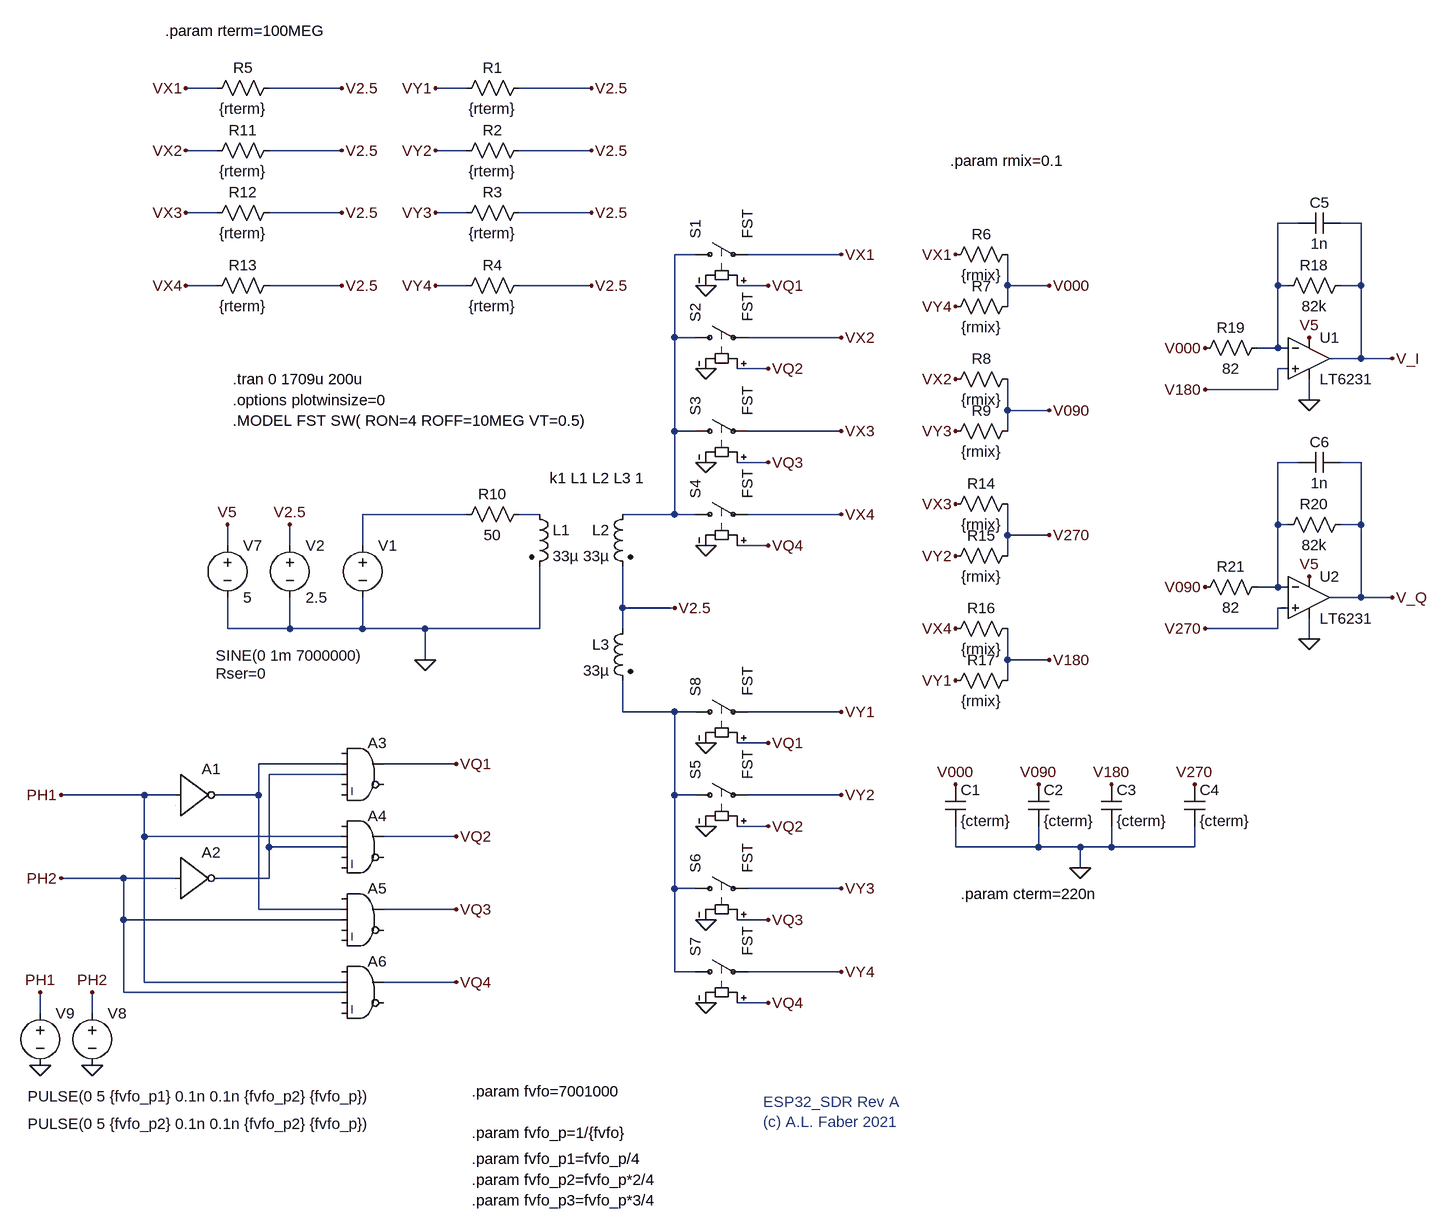
[diagram p0: schematic qsd_model.asc]
qsd_model.asc, the LTspice schematic file:
Version 4
SHEET 1 2544 1324
WIRE -176 -672 -224 -672
WIRE 16 -672 -96 -672
WIRE 208 -672 160 -672
WIRE 400 -672 288 -672
WIRE -176 -576 -224 -576
WIRE 16 -576 -96 -576
WIRE 208 -576 160 -576
WIRE 400 -576 288 -576
WIRE -176 -480 -224 -480
WIRE 16 -480 -96 -480
WIRE 208 -480 160 -480
WIRE 400 -480 288 -480
WIRE 1488 -464 1456 -464
WIRE 1584 -464 1552 -464
WIRE 560 -416 528 -416
WIRE 784 -416 640 -416
WIRE -176 -368 -224 -368
WIRE 16 -368 -96 -368
WIRE 208 -368 160 -368
WIRE 400 -368 288 -368
WIRE 672 -368 624 -368
WIRE 1040 -368 1040 -416
WIRE 1104 -368 1040 -368
WIRE 1456 -368 1456 -464
WIRE 1472 -368 1456 -368
WIRE 1584 -368 1584 -464
WIRE 1584 -368 1552 -368
WIRE 1040 -336 1040 -368
WIRE 528 -288 528 -416
WIRE 560 -288 528 -288
WIRE 784 -288 640 -288
WIRE 1456 -272 1456 -368
WIRE 1456 -272 1424 -272
WIRE 1472 -272 1456 -272
WIRE 1584 -256 1584 -368
WIRE 1584 -256 1536 -256
WIRE 1632 -256 1584 -256
WIRE 672 -240 624 -240
WIRE 1472 -240 1456 -240
WIRE 1456 -208 1456 -240
WIRE 1456 -208 1344 -208
WIRE 1504 -192 1504 -224
WIRE 1040 -176 1040 -224
WIRE 1104 -176 1040 -176
WIRE 528 -144 528 -288
WIRE 560 -144 528 -144
WIRE 784 -144 640 -144
WIRE 1040 -144 1040 -176
WIRE 672 -96 624 -96
WIRE 1488 -96 1456 -96
WIRE 1584 -96 1552 -96
WIRE 208 -16 48 -16
WIRE 320 -16 288 -16
WIRE 528 -16 528 -144
WIRE 528 -16 448 -16
WIRE 560 -16 528 -16
WIRE 784 -16 640 -16
WIRE 1456 0 1456 -96
WIRE 1472 0 1456 0
WIRE 1584 0 1584 -96
WIRE 1584 0 1552 0
WIRE 1040 16 1040 -32
WIRE 1104 16 1040 16
WIRE -160 32 -160 0
WIRE -64 32 -64 0
WIRE 48 32 48 -16
WIRE 672 32 624 32
WIRE 1040 48 1040 16
WIRE 1456 96 1456 0
WIRE 1456 96 1424 96
WIRE 1472 96 1456 96
WIRE 1584 112 1584 0
WIRE 1584 112 1536 112
WIRE 1632 112 1584 112
WIRE 448 128 448 64
WIRE 528 128 448 128
WIRE 1472 128 1456 128
WIRE -160 160 -160 112
WIRE -64 160 -64 112
WIRE -64 160 -160 160
WIRE 48 160 48 112
WIRE 48 160 -64 160
WIRE 144 160 48 160
WIRE 320 160 320 64
WIRE 320 160 144 160
WIRE 448 160 448 128
WIRE 1456 160 1456 128
WIRE 1456 160 1344 160
WIRE 1504 176 1504 144
WIRE 144 208 144 160
WIRE 1040 208 1040 160
WIRE 1104 208 1040 208
WIRE 1040 240 1040 208
WIRE 448 288 448 240
WIRE 528 288 448 288
WIRE 560 288 528 288
WIRE 784 288 640 288
WIRE 672 336 624 336
WIRE 16 368 -112 368
WIRE 192 368 80 368
WIRE 16 384 -96 384
WIRE -288 416 -416 416
WIRE -240 416 -288 416
WIRE -112 416 -112 368
WIRE -112 416 -176 416
WIRE 528 416 528 288
WIRE 560 416 528 416
WIRE 784 416 640 416
WIRE 672 464 624 464
WIRE -288 480 -288 416
WIRE 16 480 -288 480
WIRE 192 480 80 480
WIRE -96 496 -96 384
WIRE 16 496 -96 496
WIRE 960 496 960 464
WIRE 1088 496 1088 464
WIRE 1088 496 960 496
WIRE 1152 496 1088 496
WIRE 1200 496 1200 464
WIRE 1200 496 1152 496
WIRE 1328 496 1328 464
WIRE 1328 496 1200 496
WIRE 1152 528 1152 496
WIRE -320 544 -416 544
WIRE -240 544 -320 544
WIRE -96 544 -96 496
WIRE -96 544 -176 544
WIRE 528 560 528 416
WIRE 560 560 528 560
WIRE 784 560 640 560
WIRE -112 592 -112 416
WIRE 16 592 -112 592
WIRE 192 592 80 592
WIRE -320 608 -320 544
WIRE 16 608 -320 608
WIRE 672 608 624 608
WIRE 528 688 528 560
WIRE 560 688 528 688
WIRE 784 688 640 688
WIRE -288 704 -288 480
WIRE 16 704 -288 704
WIRE 192 704 80 704
WIRE -320 720 -320 608
WIRE 16 720 -320 720
WIRE 672 736 624 736
WIRE -448 752 -448 720
WIRE -368 752 -368 720
FLAG -64 0 V2.5
FLAG -160 0 V5
FLAG 576 -368 0
FLAG 576 -240 0
FLAG 576 -96 0
FLAG 576 32 0
FLAG -416 544 PH2
FLAG -448 720 PH1
FLAG -368 720 PH2
FLAG -448 832 0
FLAG -368 832 0
FLAG 192 480 VQ2
FLAG 192 592 VQ3
FLAG 192 704 VQ4
FLAG 192 368 VQ1
FLAG 400 -672 V2.5
FLAG 400 -576 V2.5
FLAG 400 -480 V2.5
FLAG 400 -368 V2.5
FLAG 672 -368 VQ1
FLAG 144 208 0
FLAG 672 -240 VQ2
FLAG 672 -96 VQ3
FLAG 672 32 VQ4
FLAG 576 336 0
FLAG 576 464 0
FLAG 576 608 0
FLAG 576 736 0
FLAG 672 336 VQ1
FLAG 672 464 VQ2
FLAG 672 608 VQ3
FLAG 672 736 VQ4
FLAG 528 128 V2.5
FLAG 784 -416 VX1
FLAG 160 -672 VY1
FLAG 784 -288 VX2
FLAG 160 -576 VY2
FLAG 784 -144 VX3
FLAG 160 -480 VY3
FLAG 160 -368 VY4
FLAG 784 -16 VX4
FLAG 16 -672 V2.5
FLAG 16 -576 V2.5
FLAG 16 -480 V2.5
FLAG 16 -368 V2.5
FLAG -224 -672 VX1
FLAG -224 -576 VX2
FLAG -224 -480 VX3
FLAG -224 -368 VX4
FLAG 784 288 VY1
FLAG 784 416 VY2
FLAG 784 560 VY3
FLAG 784 688 VY4
FLAG 960 -416 VX1
FLAG 960 -336 VY4
FLAG 1104 -368 V000
FLAG 960 -224 VX2
FLAG 960 -144 VY3
FLAG 1104 -176 V090
FLAG 960 -32 VX3
FLAG 960 48 VY2
FLAG 1104 16 V270
FLAG 960 160 VX4
FLAG 960 240 VY1
FLAG 1104 208 V180
FLAG 960 400 V000
FLAG 1088 400 V090
FLAG 1200 400 V180
FLAG 1328 400 V270
FLAG 1152 528 0
FLAG 1504 -288 V5
FLAG 1504 -192 0
FLAG 1344 -272 V000
FLAG 1344 -208 V180
FLAG 1632 -256 V_I
FLAG 1504 80 V5
FLAG 1504 176 0
FLAG 1344 96 V090
FLAG 1344 160 V270
FLAG 1632 112 V_Q
FLAG -416 416 PH1
SYMBOL voltage 48 16 R0
WINDOW 3 -226 185 Left 2
WINDOW 123 0 0 Left 0
WINDOW 39 -226 213 Left 2
SYMATTR Value SINE(0 1m 7000000)
SYMATTR SpiceLine Rser=0
SYMATTR InstName V1
SYMBOL voltage -64 16 R0
WINDOW 123 0 0 Left 0
WINDOW 39 0 0 Left 0
SYMATTR InstName V2
SYMATTR Value 2.5
SYMBOL voltage -160 16 R0
WINDOW 123 0 0 Left 0
WINDOW 39 0 0 Left 0
SYMATTR InstName V7
SYMATTR Value 5
SYMBOL sw 544 -288 R270
SYMATTR InstName S2
SYMATTR Value FST
SYMBOL sw 544 -144 R270
SYMATTR InstName S3
SYMATTR Value FST
SYMBOL sw 544 -16 R270
SYMATTR InstName S4
SYMATTR Value FST
SYMBOL Digital\\inv -240 352 R0
SYMATTR InstName A1
SYMBOL Digital\\inv -240 480 R0
SYMATTR InstName A2
SYMBOL Digital\\and 48 320 R0
SYMATTR InstName A3
SYMBOL Digital\\and 48 432 R0
SYMATTR InstName A4
SYMBOL Digital\\and 48 544 R0
SYMATTR InstName A5
SYMBOL Digital\\and 48 656 R0
SYMATTR InstName A6
SYMBOL voltage -368 736 R0
WINDOW 3 -99 186 Left 2
WINDOW 123 0 0 Left 0
WINDOW 39 0 0 Left 0
SYMATTR Value PULSE(0 5 {fvfo_p2} 0.1n 0.1n {fvfo_p2} {fvfo_p})
SYMATTR InstName V8
SYMBOL voltage -448 736 R0
WINDOW 3 -19 144 Left 2
WINDOW 123 0 0 Left 0
WINDOW 39 0 0 Left 0
SYMATTR Value PULSE(0 5 {fvfo_p1} 0.1n 0.1n {fvfo_p2} {fvfo_p})
SYMATTR InstName V9
SYMBOL sw 544 -416 R270
SYMATTR InstName S1
SYMATTR Value FST
SYMBOL res 304 -688 R90
WINDOW 0 0 56 VBottom 2
WINDOW 3 32 56 VTop 2
SYMATTR InstName R1
SYMATTR Value {rterm}
SYMBOL res 304 -592 R90
WINDOW 0 0 56 VBottom 2
WINDOW 3 32 56 VTop 2
SYMATTR InstName R2
SYMATTR Value {rterm}
SYMBOL res 304 -496 R90
WINDOW 0 0 56 VBottom 2
WINDOW 3 32 56 VTop 2
SYMATTR InstName R3
SYMATTR Value {rterm}
SYMBOL res 304 -384 R90
WINDOW 0 0 56 VBottom 2
WINDOW 3 32 56 VTop 2
SYMATTR InstName R4
SYMATTR Value {rterm}
SYMBOL sw 544 416 R270
SYMATTR InstName S5
SYMATTR Value FST
SYMBOL sw 544 560 R270
SYMATTR InstName S6
SYMATTR Value FST
SYMBOL sw 544 688 R270
SYMATTR InstName S7
SYMATTR Value FST
SYMBOL sw 544 288 R270
SYMATTR InstName S8
SYMATTR Value FST
SYMBOL res 304 -32 R90
WINDOW 0 0 56 VBottom 2
WINDOW 3 32 56 VTop 2
SYMATTR InstName R10
SYMATTR Value 50
SYMBOL ind2 304 -32 R0
SYMATTR InstName L1
SYMATTR Value 33µ
SYMATTR Type ind
SYMBOL ind2 464 -32 M0
SYMATTR InstName L2
SYMATTR Value 33µ
SYMATTR Type ind
SYMBOL ind2 464 144 M0
SYMATTR InstName L3
SYMATTR Value 33µ
SYMATTR Type ind
SYMBOL res -80 -688 R90
WINDOW 0 0 56 VBottom 2
WINDOW 3 32 56 VTop 2
SYMATTR InstName R5
SYMATTR Value {rterm}
SYMBOL res -80 -592 R90
WINDOW 0 0 56 VBottom 2
WINDOW 3 32 56 VTop 2
SYMATTR InstName R11
SYMATTR Value {rterm}
SYMBOL res -80 -496 R90
WINDOW 0 0 56 VBottom 2
WINDOW 3 32 56 VTop 2
SYMATTR InstName R12
SYMATTR Value {rterm}
SYMBOL res -80 -384 R90
WINDOW 0 0 56 VBottom 2
WINDOW 3 32 56 VTop 2
SYMATTR InstName R13
SYMATTR Value {rterm}
SYMBOL res 1056 -432 R90
WINDOW 0 0 56 VBottom 2
WINDOW 3 32 56 VTop 2
SYMATTR InstName R6
SYMATTR Value {rmix}
SYMBOL res 1056 -352 R90
WINDOW 0 0 56 VBottom 2
WINDOW 3 32 56 VTop 2
SYMATTR InstName R7
SYMATTR Value {rmix}
SYMBOL res 1056 -240 R90
WINDOW 0 0 56 VBottom 2
WINDOW 3 32 56 VTop 2
SYMATTR InstName R8
SYMATTR Value {rmix}
SYMBOL res 1056 -160 R90
WINDOW 0 0 56 VBottom 2
WINDOW 3 32 56 VTop 2
SYMATTR InstName R9
SYMATTR Value {rmix}
SYMBOL res 1056 -48 R90
WINDOW 0 0 56 VBottom 2
WINDOW 3 32 56 VTop 2
SYMATTR InstName R14
SYMATTR Value {rmix}
SYMBOL res 1056 32 R90
WINDOW 0 0 56 VBottom 2
WINDOW 3 32 56 VTop 2
SYMATTR InstName R15
SYMATTR Value {rmix}
SYMBOL res 1056 144 R90
WINDOW 0 0 56 VBottom 2
WINDOW 3 32 56 VTop 2
SYMATTR InstName R16
SYMATTR Value {rmix}
SYMBOL res 1056 224 R90
WINDOW 0 0 56 VBottom 2
WINDOW 3 32 56 VTop 2
SYMATTR InstName R17
SYMATTR Value {rmix}
SYMBOL cap 944 400 R0
SYMATTR InstName C1
SYMATTR Value {cterm}
SYMBOL cap 1072 400 R0
SYMATTR InstName C2
SYMATTR Value {cterm}
SYMBOL cap 1184 400 R0
SYMATTR InstName C3
SYMATTR Value {cterm}
SYMBOL cap 1312 400 R0
SYMATTR InstName C4
SYMATTR Value {cterm}
SYMBOL Opamps\\LT6231 1504 -256 R0
SYMATTR InstName U1
SYMBOL res 1568 -384 R90
WINDOW 0 0 56 VBottom 2
WINDOW 3 32 56 VTop 2
SYMATTR InstName R18
SYMATTR Value 82k
SYMBOL cap 1552 -480 R90
WINDOW 0 0 32 VBottom 2
WINDOW 3 32 32 VTop 2
SYMATTR InstName C5
SYMATTR Value 1n
SYMBOL res 1440 -288 R90
WINDOW 0 0 56 VBottom 2
WINDOW 3 32 56 VTop 2
SYMATTR InstName R19
SYMATTR Value 82
SYMBOL Opamps\\LT6231 1504 112 R0
SYMATTR InstName U2
SYMBOL res 1568 -16 R90
WINDOW 0 0 56 VBottom 2
WINDOW 3 32 56 VTop 2
SYMATTR InstName R20
SYMATTR Value 82k
SYMBOL cap 1552 -112 R90
WINDOW 0 0 32 VBottom 2
WINDOW 3 32 32 VTop 2
SYMATTR InstName C6
SYMATTR Value 1n
SYMBOL res 1440 80 R90
WINDOW 0 0 56 VBottom 2
WINDOW 3 32 56 VTop 2
SYMATTR InstName R21
SYMATTR Value 82
TEXT 216 872 Left 2 !.param fvfo=7001000
TEXT -152 -224 Left 2 !.tran 0 1709u 200u
TEXT 216 936 Left 2 !.param fvfo_p=1/{fvfo}
TEXT 216 976 Left 2 !.param fvfo_p1=fvfo_p/4
TEXT 216 1008 Left 2 !.param fvfo_p2=fvfo_p*2/4
TEXT 216 1040 Left 2 !.param fvfo_p3=fvfo_p*3/4
TEXT -152 -192 Left 2 !.options plotwinsize=0
TEXT -152 -160 Left 2 !.MODEL FST SW( RON=4 ROFF=10MEG VT=0.5)
TEXT 336 -72 Left 2 !k1 L1 L2 L3 1
TEXT -256 -760 Left 2 !.param rterm=100MEG
TEXT 952 -560 Left 2 !.param rmix=0.1
TEXT 968 568 Left 2 !.param cterm=220n
TEXT 664 888 Left 2 ;ESP32_SDR Rev A \n(c) A.L. Faber 2021

The netlist it stands for:
* qsd_model.asc
V1 N004 0 SINE(0 1m 7000000) Rser=0
V2 V2.5 0 2.5
V7 V5 0 5
S2 N002 VX2 VQ2 0 FST
S3 N002 VX3 VQ3 0 FST
S4 N002 VX4 VQ4 0 FST
A1 PH1 0 0 0 0 N007 0 0 BUF
A2 PH2 0 0 0 0 N008 0 0 BUF
A3 0 N007 N008 0 0 0 VQ1 0 AND
A4 0 PH1 N008 0 0 0 VQ2 0 AND
A5 0 N007 PH2 0 0 0 VQ3 0 AND
A6 0 PH1 PH2 0 0 0 VQ4 0 AND
V8 PH2 0 PULSE(0 5 {fvfo_p2} 0.1n 0.1n {fvfo_p2} {fvfo_p})
V9 PH1 0 PULSE(0 5 {fvfo_p1} 0.1n 0.1n {fvfo_p2} {fvfo_p})
S1 N002 VX1 VQ1 0 FST
R1 V2.5 VY1 {rterm}
R2 V2.5 VY2 {rterm}
R3 V2.5 VY3 {rterm}
R4 V2.5 VY4 {rterm}
S5 N006 VY2 VQ2 0 FST
S6 N006 VY3 VQ3 0 FST
S7 N006 VY4 VQ4 0 FST
S8 N006 VY1 VQ1 0 FST
R10 N005 N004 50
L1 N005 0 33µ
L2 N002 V2.5 33µ
L3 V2.5 N006 33µ
R5 V2.5 VX1 {rterm}
R11 V2.5 VX2 {rterm}
R12 V2.5 VX3 {rterm}
R13 V2.5 VX4 {rterm}
R6 V000 VX1 {rmix}
R7 V000 VY4 {rmix}
R8 V090 VX2 {rmix}
R9 V090 VY3 {rmix}
R14 V270 VX3 {rmix}
R15 V270 VY2 {rmix}
R16 V180 VX4 {rmix}
R17 V180 VY1 {rmix}
C1 V000 0 {cterm}
C2 V090 0 {cterm}
C3 V180 0 {cterm}
C4 V270 0 {cterm}
XU1 V180 N001 V_I V5 0 LT6231  ; pins In+ In- OUT V+ V-
R18 V_I N001 82k
C5 V_I N001 1n
R19 N001 V000 82
XU2 V270 N003 V_Q V5 0 LT6231  ; pins In+ In- OUT V+ V-
R20 V_Q N003 82k
C6 V_Q N003 1n
R21 N003 V090 82
.param fvfo=7001000
.tran 0 1709u 200u
.param fvfo_p=1/{fvfo}
.param fvfo_p1=fvfo_p/4
.param fvfo_p2=fvfo_p*2/4
.param fvfo_p3=fvfo_p*3/4
.options plotwinsize=0
.MODEL FST SW( RON=4 ROFF=10MEG VT=0.5)
k1 L1 L2 L3 1
.param rterm=100MEG
.param rmix=0.1
.param cterm=220n
* ESP32_SDR Rev A
* (c) A.L. Faber 2021
.lib LTC2.lib
.backanno
.end